# EAGLE design BPM_RULE_COMPLIANT_itr1_ver1 (EAGLE 9.6.2)
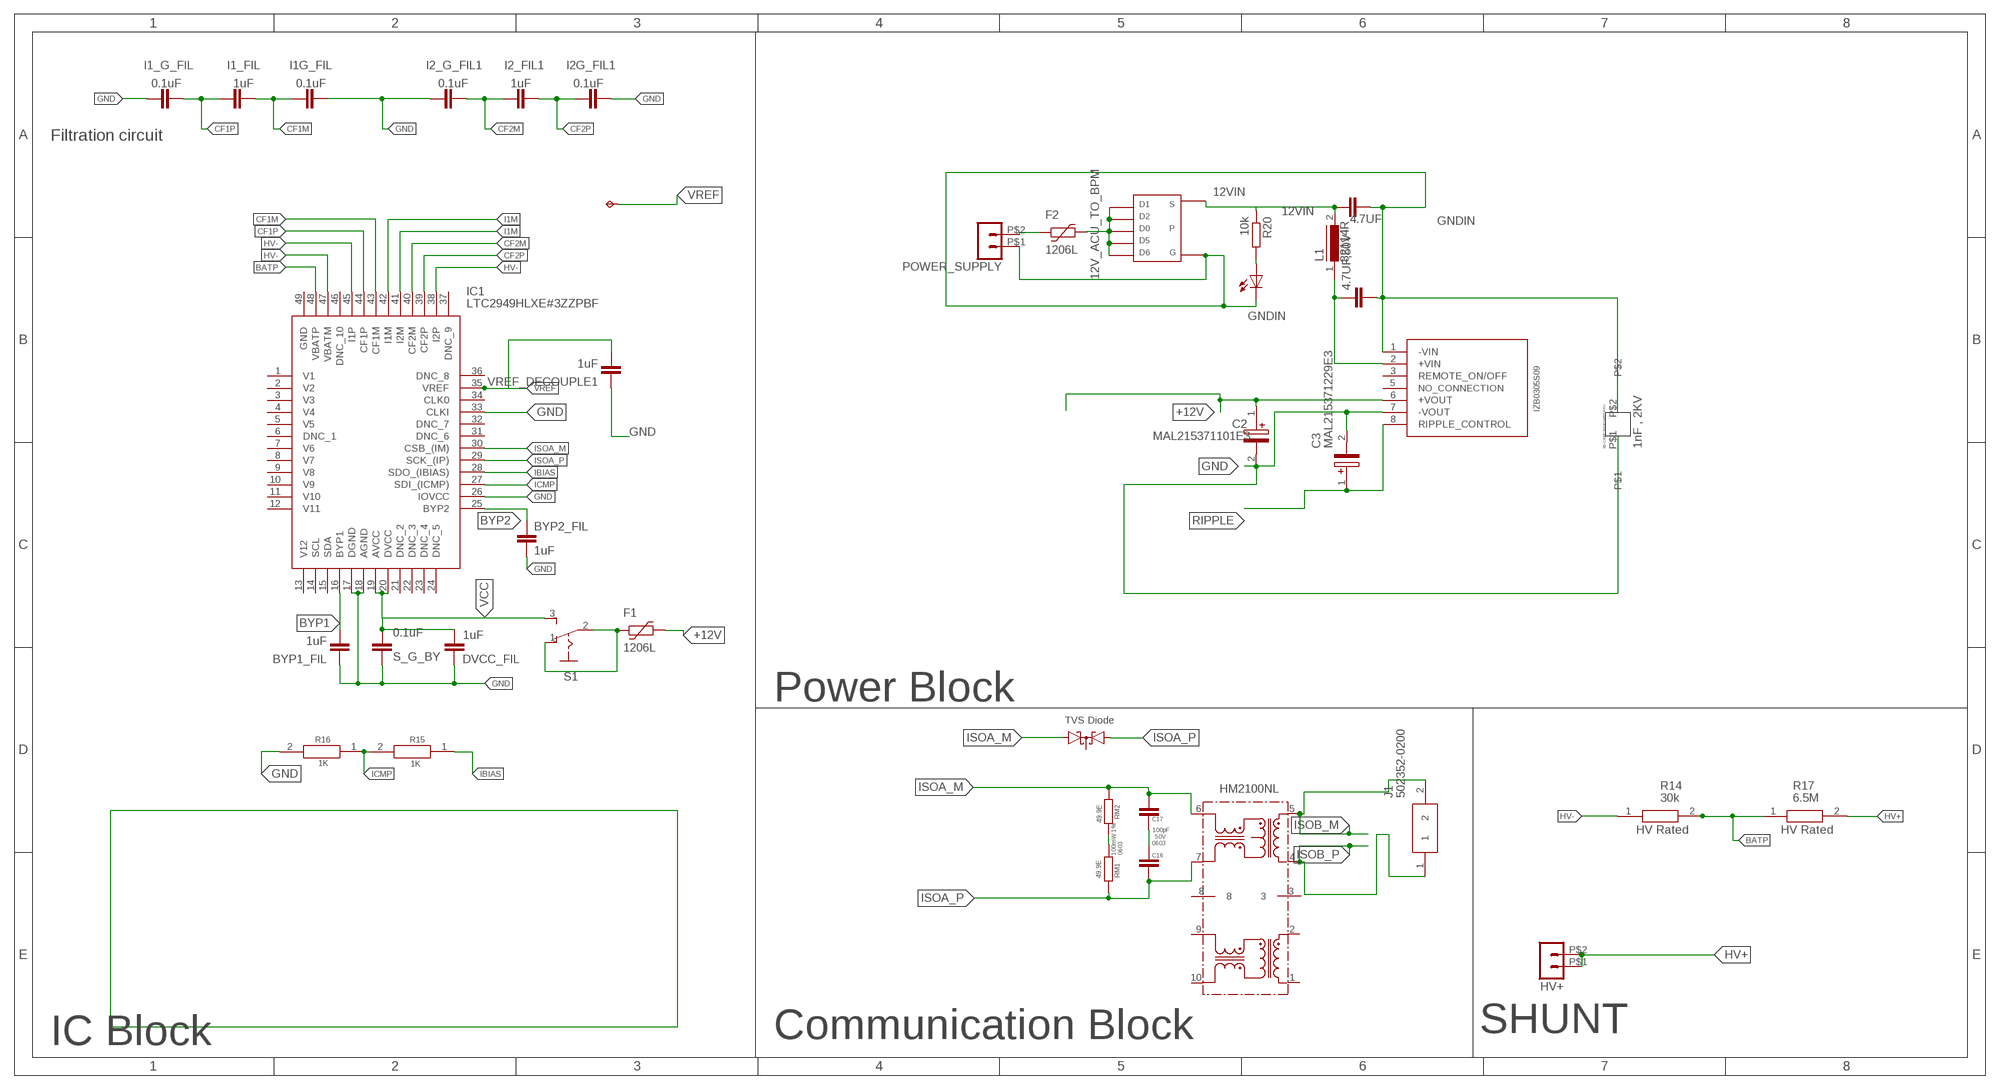
[diagram p0: schematic, sheet 1]

## Parts
4.7UF  C-EUC1206  [C1206]
4.7UF,50V  C-EUC1206  [C1206]
BYP1_FIL  1uF  C-EUC0603  [C0603]
BYP2_FIL  1uF  C-EUC0603  [C0603]
C2  MAL215371101E3  [CAPAE1060X1060N]
C3  MAL215371229E3  [CAPAE860X680N]
C15  TPPAD1-13  [P1-13]
C16  100pF  C-EUC0603  [C0603]
C17  100pF  C-EUC0603  [C0603]
DVCC_FIL  1uF  C-EUC0603  [C0603]
F1  1206L  [1206L]
F2  1206L  [1206L]
HM2100NL  HM2100NL  [HM2100NL]
HV+  MOLEX2PIN43650-0200  [43650-0200]
I1_FIL  1uF  C-EUC0603  [C0603]
I1_G_FIL  0.1uF  C-EUC0603  [C0603]
I1G_FIL  0.1uF  C-EUC0603  [C0603]
I2_FIL1  1uF  C-EUC0603  [C0603]
I2_G_FIL1  0.1uF  C-EUC0603  [C0603]
I2G_FIL1  0.1uF  C-EUC0603  [C0603]
IC1  LTC2949HLXE#3ZZPBF  [QFP50P900X900X160-49N]
IM1  TVS  BAS40-05  [SOT23]
J1  502352-0200  [5023520200]
L1  82114R  [82114R]
POWER_SUPPLY  MOLEX2PIN43045-0212  [43045-0212]
PWR_LED  LED-FKIT-1206  [FKIT-LED-1206]
R14  30k  HV73V2BTTD6494F  [RESC3216X70N]
R15  1K  CRCW06031K00FKEC  [RESC1608X50N]
R16  1K  CRCW06031K00FKEC  [RESC1608X50N]
R17  6.5M  HV73V2BTTD6494F  [RESC3216X70N]
R20  10k  R-EU_R0805  [R0805]
RM1  49.9E  R-EU_R0603  [R0603]
RM2  49.9E  R-EU_R0603  [R0603]
S1  STS121PC04  [STS121PC04]
S_G_BY  0.1uF  C-EUC0603  [C0603]
U$1  BPM_CONV  [BPM_CONV]
U$2  80-C330C102KGR5TATU  [80-C330C102KGR5TATU]
U$10  TSOP-6_PMOS  [TSOP-6_PMOS]
VREF_DECOUPLE1  1uF  C-EUC0603  [C0603]

## Nets
12V_ACU_TO_BPM: F2.P$2 U$10.1 U$10.2 U$10.5 U$10.6 U$10.D(D0)
12VIN: 4.7UF.1 L1.2 R20.1 U$10.S
+12V: C2.1(+) F1.P$2 U$1.6(+VOUT)
BATP: IC1.48(VBATP) R14.2 R17.1
BYP1: BYP1_FIL.2 IC1.16(BYP1)
BYP2: BYP2_FIL.1 IC1.25(BYP2)
CF1M: I1_FIL.1 I1G_FIL.1 IC1.43(CF1M)
CF1P: I1_FIL.2 I1_G_FIL.2 IC1.44(CF1P)
CF2M: I2_FIL1.2 I2_G_FIL1.1 IC1.40(CF2M)
CF2P: I2_FIL1.1 I2G_FIL1.1 IC1.39(CF2P)
GND: BYP1_FIL.1 BYP2_FIL.2 C2.2(-) C3.2(-) DVCC_FIL.1 I1_G_FIL.1 I1G_FIL.2 I2_G_FIL1.2 I2G_FIL1.2 IC1.17(DGND) IC1.18(AGND) IC1.26(IOVCC) IC1.33(CLKI) R16.2 S_G_BY.1 U$1.7(-VOUT) U$2.P$1 VREF_DECOUPLE1.1
GNDIN: 4.7UF,50V.2 4.7UF.2 POWER_SUPPLY.P$1 PWR_LED.C U$1.1(-VIN) U$2.P$2 U$10.G
HV+: HV+.P$1 HV+.P$2 R17.2
HV-: IC1.38(I2P) IC1.45(I1P) IC1.47(VBATM) R14.1
I1M: IC1.41(I2M) IC1.42(I1M)
IBIAS: IC1.28(SDO_(IBIAS)) R15.1
ICMP: IC1.27(SDI_(ICMP)) R15.2 R16.1
ISOA_M: C17.2 HM2100NL.6 IC1.30(CSB_(IM)) IM1.2(A2) RM2.1
ISOA_P: C16.1 HM2100NL.7 IC1.29(SCK_(IP)) IM1.1(A1) RM1.2
ISOB_M: HM2100NL.5 J1.2
ISOB_P: HM2100NL.4 J1.1
N$: RM1.1 RM2.2
N$1: 4.7UF,50V.1 L1.1 U$1.2(+VIN)
N$3: F2.P$1 POWER_SUPPLY.P$2
N$5: PWR_LED.A R20.2
N$8: F1.P$1 S1.1(O) S1.2(P)
N$15: C16.2 C17.1
RIPPLE: C3.1(+) U$1.8(RIPPLE_CONTROL)
VCC: DVCC_FIL.2 IC1.19(AVCC) IC1.20(DVCC) S1.3(S) S_G_BY.2
VREF: C15.TP IC1.35(VREF) VREF_DECOUPLE1.2
Unconnected: HM2100NL.1 HM2100NL.2 HM2100NL.3 HM2100NL.8 HM2100NL.9 HM2100NL.10 IC1.1(V1) IC1.2(V2) IC1.3(V3) IC1.4(V4) IC1.5(V5) IC1.6(DNC_1) IC1.7(V6) IC1.8(V7) IC1.9(V8) IC1.10(V9) IC1.11(V10) IC1.12(V11) IC1.13(V12) IC1.14(SCL) IC1.15(SDA) IC1.21(DNC_2) IC1.22(DNC_3) IC1.23(DNC_4) IC1.24(DNC_5) IC1.31(DNC_6) IC1.32(DNC_7) IC1.34(CLK0) IC1.36(DNC_8) IC1.37(DNC_9) IC1.46(DNC_10) IC1.49(GND) IM1.3(C) U$1.3(REMOTE_ON/OFF)

## Notes on the sheet
- Filtration circuit
- Power Block
- TVS Diode
- HV Rated | HV Rated
- 50V
  0603
- 100mW 1%
  0603
- IC Block | Communication Block | SHUNT

## Library data of the parts
4.7UF 4.7UF,50V = IIT_BOMBAY_Racing:C-EU: CAPACITOR, European symbol
BYP1_FIL BYP2_FIL DVCC_FIL I1_FIL I1_G_FIL I1G_FIL I2_FIL1 I2_G_FIL1 I2G_FIL1 S_G_BY VREF_DECOUPLE1 = rcl:C-EU: CAPACITOR, European symbol; SPICEPREFIX: C
C2 = SamacSys_Parts:MAL215371101E3: Aluminum Electrolytic Capacitors - SMD 100uF 50volts Source: Datasheet <https://datasheet.datasheetarchive.com/originals/distributors/DKDS-23/453117.pdf>; DESCRIPTION: Aluminum Electrolytic Capacitors - SMD 100uF 50volts; HEIGHT: 10.6mm; MANUFACTURER_NAME: Vishay; MANUFACTURER_PART_NUMBER: MAL215371101E3; MOUSER_PART_NUMBER: 594-MAL215371101E3; MOUSER_PRICE-STOCK: https://www.mouser.co.uk/ProductDetail/Vishay-BC-Components/MAL215371101E3?qs=qmStTZH4TzkcbcK0Zbtrsw%3D%3D
C3 = SamacSys_Parts:MAL215371229E3: Aluminum Electrolytic Capacitors - SMD 50V 22uF 20% Source: Datasheet <https://www.vishay.com/docs/28388/153crv.pdf>; DESCRIPTION: Aluminum Electrolytic Capacitors - SMD 50V 22uF 20%; HEIGHT: 6.8mm; MANUFACTURER_NAME: Vishay; MANUFACTURER_PART_NUMBER: MAL215371229E3; MOUSER_PART_NUMBER: 594-MAL215371229E3; MOUSER_PRICE-STOCK: https://www.mouser.co.uk/ProductDetail/Vishay-BC-Components/MAL215371229E3?qs=qmStTZH4TzmrNC0jpxbHVw%3D%3D
C15 = testpad:TP: Test pad
C16 C17 = resistor:C-EU: CAPACITOR, European symbol; MID: GCD188R71H103KA01D
F1 F2 = IIT_BOMBAY_Racing:1206L
HM2100NL = HM2100NL:HM2100NL
HV+ POWER_SUPPLY = IIT_BOMBAY_Racing2 (1):MOLEX2PIN: Molex - Micro-Fit 3.0 Series connector, 3.00mm (0.118") pitch header, 2 positions.
IC1 = SamacSys_Parts:LTC2949HLXE#3ZZPBF: Battery Management 60V Bat Gas Gauge w/ Temp, V & C Measure Source: Datasheet <https://www.analog.com/media/en/technical-documentation/data-sheets/LTC2949.pdf>; DESCRIPTION: Battery Management 60V Bat Gas Gauge w/ Temp, V & C Measure; HEIGHT: 1.6mm; MANUFACTURER_NAME: Analog Devices; MANUFACTURER_PART_NUMBER: LTC2949HLXE#3ZZPBF; MOUSER_PART_NUMBER: 584-949HLXE#3ZZPBF; MOUSER_PRICE-STOCK: https://www.mouser.co.uk/ProductDetail/Analog-Devices-Linear-Technology/LTC2949HLXE3ZZPBF?qs=wnTfsH77Xs63l8yDYlqztA%3D%3D
IM1 = diode:BAS40-05: Silicon Schottky Diodes General-purpose diode for high-speed switching
J1 = SamacSys_Parts:502352-0200: Molex DURACLIK 502352, 2mm Pitch, 2 Way, 1 Row, Right Angle PCB Header, Surface Mount Source: Datasheet <https://www.molex.com/pdm_docs/sd/5023520200_sd.pdf>; DESCRIPTION: Molex DURACLIK 502352, 2mm Pitch, 2 Way, 1 Row, Right Angle PCB Header, Surface Mount; HEIGHT: mm; MANUFACTURER_NAME: Molex; MANUFACTURER_PART_NUMBER: 502352-0200; MOUSER_PART_NUMBER: 538-502352-0200; MOUSER_PRICE-STOCK: https://www.mouser.co.uk/ProductDetail/Molex/502352-0200?qs=cPOO8qjhL6OPJnOOkJoW%252Bw%3D%3D
L1 = inductors:82114R: INDUCTOR; SPICEPREFIX: L
PWR_LED = IIT_BOMBAY_Racing:LED: LEDs Standard schematic elements and footprints for 5mm, 3mm, 1206, and 0603 sized LEDs. 5mm - Spark Fun Electronics SKU : COM-00529 (and others)
R14 R17 = SamacSys_Parts:HV73V2BTTD6494F: Thick Film Resistors - SMD 6490000Ohms 1% 1206 TCR=100 AEC-Q200 Source: Datasheet <https://www.mouser.ch/datasheet/2/219/HV73V-958787.pdf>; DESCRIPTION: Thick Film Resistors - SMD 6490000Ohms 1% 1206 TCR=100 AEC-Q200; HEIGHT: 0.7mm; MANUFACTURER_NAME: KOA Speer; MANUFACTURER_PART_NUMBER: HV73V2BTTD6494F
R15 R16 = SamacSys_Parts:CRCW06031K00FKEC: VISHAY - CRCW06031K00FKEC - RES, AEC-Q200, THICK FILM, 1K, 0.1W, 0603 Source: Datasheet <http://www.vishay.com/docs/20035/dcrcwe3.pdf>; ARROW_PART_NUMBER: CRCW06031K00FKEC; ARROW_PRICE-STOCK: https://www.arrow.com/en/products/crcw06031k00fkec/vishay; DESCRIPTION: VISHAY - CRCW06031K00FKEC - RES, AEC-Q200, THICK FILM, 1K, 0.1W, 0603; HEIGHT: 0.5mm; MANUFACTURER_NAME: Vishay; MANUFACTURER_PART_NUMBER: CRCW06031K00FKEC; MOUSER_PART_NUMBER: 71-CRCW06031K00FKEC; MOUSER_PRICE-STOCK: https://www.mouser.co.uk/ProductDetail/Vishay-Dale/CRCW06031K00FKEC?qs=LTJBsG9vER03gQprIr9%2F9w%3D%3D
R20 = IIT_BOMBAY_Racing:R-EU_: RESISTOR, European symbol
RM1 RM2 = resistor:R-EU_: RESISTOR, European symbol; MID: CRCW0603120RFKEAHP
S1 = switches:STS121PC04: SLIDING SWITCH Distributor Buerklin, 11G810
U$1 = BPM_CONV:BPM_CONV
U$2 = 80-C330C102KGR5TATU:80-C330C102KGR5TATU
U$10 = TSOP-6_MOS:TSOP-6_PMOS

## Net classes
0 default: width 0.127 mm, drill 0.127 mm, clearance 0.127 mm
1 differential: width 0.305 mm

## Board
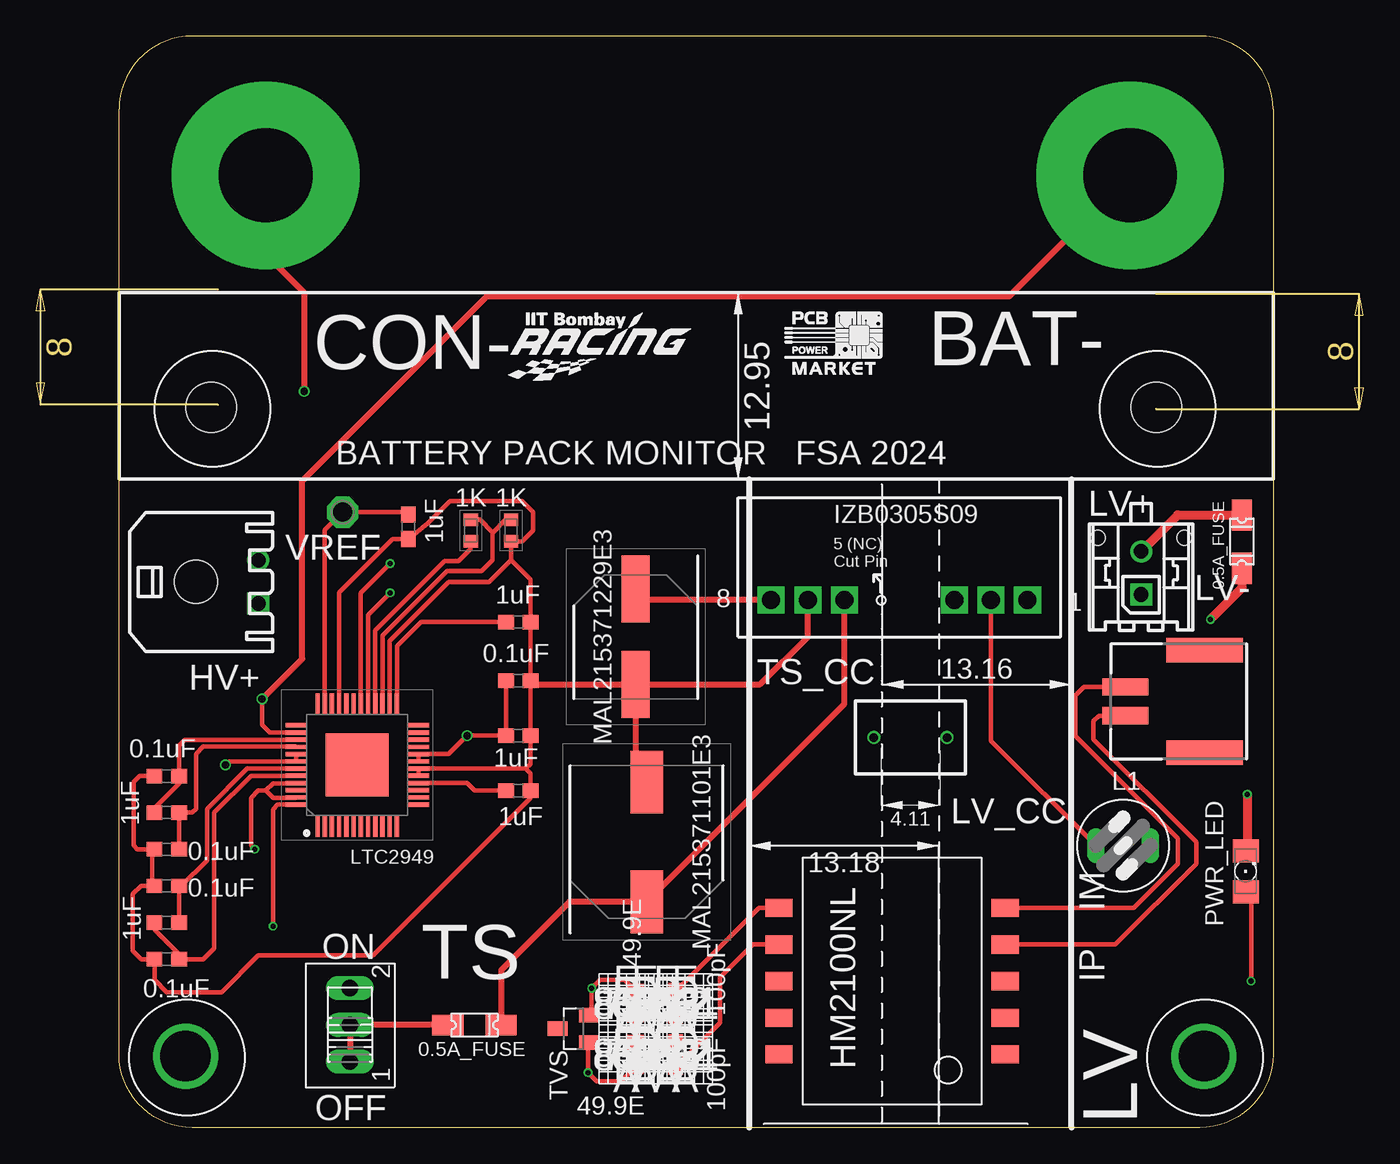
[diagram p1: board, top side]
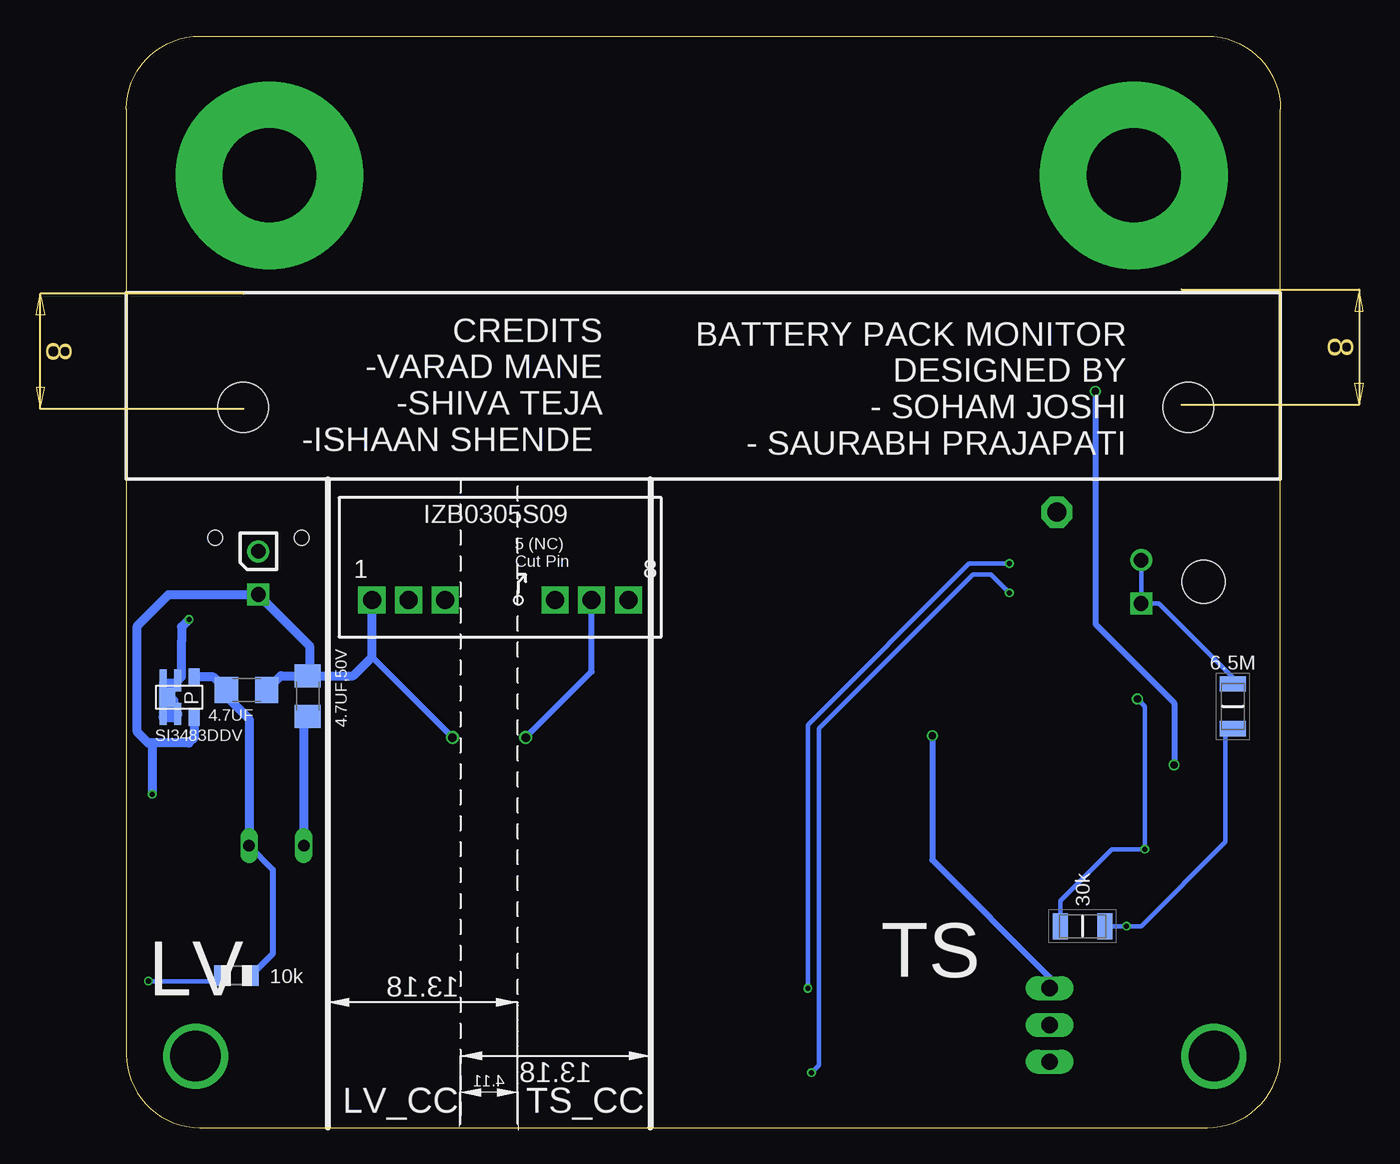
[diagram p2: board, bottom side, seen from below]

Size 80.01 x 75.69 mm. Coordinates in mm from the lower left corner, seen from the top.
Outline: 80.01,70.61 80.01,5.08 arc-90 74.93,0 5.08,0 arc-90 0,5.08 0,70.61 arc-90 5.08,75.69 74.93,75.69 arc-90 80.01,70.61
Copper layers (1*16): Top 0.035mm / dielectric 1.5mm / Bottom 0.035mm
Design rules "PCB_Power": minimum track width 5mil, minimum drill 10mil, track to track 5mil, track to pad 5mil, pad to pad 5mil, via to via 5mil, smd to smd 5mil, copper to edge 10mil, drill to drill 6mil, minimum pad ring 5mil, minimum via ring 5mil, stop-mask expansion 3mil, vias tented up to drill 0mil, thermal gap 10mil
Holes 3.5 mm at 6.39,49.95 71.92,49.95

### Footprints (pad centres in the part's own frame; a part is rotated, then mirrored left to right if it is on the bottom)
C1206 = smd 1.6 x 1.8: 1 -1.4,0; 2 1.4,0
C0603 = smd 1.1 x 1: 1 -0.85,0; 2 0.85,0
CAPAE1060X1060N = smd 4.35 x 2.25: 1 -4.15,0; 2 4.15,0
CAPAE860X680N = smd 4.65 x 1.95: 1 -3.3,0; 2 3.3,0
P1-13 = drill 1.321 pad 2.159 octagon: TP 0,0
1206L = smd 2.16 x 1.4: P$1 -1.85,0; P$2 1.85,0
HM2100NL = smd 1.27 x 1.89: 1 -5.08,-7.84; 2 -2.54,-7.84; 3 0,-7.84; 4 2.54,-7.84; 5 5.08,-7.84; 6 5.08,7.84; 7 2.54,7.84; 8 0,7.84; 9 -2.54,7.84; 10 -5.08,7.84
43650-0200 = drill 1.02 square: P$1 1.5,4.32 | drill 1.02: P$2 -1.5,4.32 | hole 3: 0,0
QFP50P900X900X160-49N = smd 1.475 x 0.3: 1 -4.238,2.75; 2 -4.238,2.25; 3 -4.238,1.75; 4 -4.238,1.25; 5 -4.238,0.75; 6 -4.238,0.25; 7 -4.238,-0.25; 8 -4.238,-0.75; 9 -4.238,-1.25; 10 -4.238,-1.75; 11 -4.238,-2.25; 12 -4.238,-2.75; 25 4.238,-2.75; 26 4.238,-2.25; 27 4.238,-1.75; 28 4.238,-1.25; 29 4.238,-0.75; 30 4.238,-0.25; 31 4.238,0.25; 32 4.238,0.75; 33 4.238,1.25; 34 4.238,1.75; 35 4.238,2.25; 36 4.238,2.75 | smd 0.3 x 1.475: 13 -2.75,-4.238; 14 -2.25,-4.238; 15 -1.75,-4.238; 16 -1.25,-4.238; 17 -0.75,-4.238; 18 -0.25,-4.238; 19 0.25,-4.238; 20 0.75,-4.238; 21 1.25,-4.238; 22 1.75,-4.238; 23 2.25,-4.238; 24 2.75,-4.238; 37 2.75,4.238; 38 2.25,4.238; 39 1.75,4.238; 40 1.25,4.238; 41 0.75,4.238; 42 0.25,4.238; 43 -0.25,4.238; 44 -0.75,4.238; 45 -1.25,4.238; 46 -1.75,4.238; 47 -2.25,4.238; 48 -2.75,4.238 | smd 4.35 x 4.35: 49 0,0
SOT23 = smd 1 x 1.4: 1 -0.95,-1.1; 2 0.95,-1.1; 3 0,1.1
5023520200 = smd 1.2 x 3.2: 1 -1,-1; 2 1,-1 | smd 1.7 x 5.3: 3 -3.55,-6.48; 4 3.55,-6.48
82114R = drill 0.813 long: 1 0,1.905; 2 0,-1.905
43045-0212 = drill 1.02 square: P$1 0,0 | drill 1.02: P$2 0,3 | hole 1.02: 3,3.94; -3,3.94
FKIT-LED-1206 = smd 1.6 x 1.803: A -1.422,0; C 1.422,0
RESC3216X70N = smd 1.05 x 1.8: 1 -1.55,0; 2 1.55,0
RESC1608X50N = smd 0.85 x 1: 1 -0.75,0; 2 0.75,0
R0805 = smd 1.1 x 1.4: 1 -1,0; 2 1,0
R0603 = smd 1 x 1.1: 1 -0.85,0; 2 0.85,0
STS121PC04 = drill 1.118 long: 1 -3.81,0; 2 -1.27,0; 3 1.29,0
BPM_CONV = drill 1.25 square: 1 0,0; 2 -2.54,0; 3 -5.08,0; 6 -12.7,0; 7 -15.24,0; 8 -17.78,0
80-C330C102KGR5TATU = drill 0.6: P$1 -2.54,0; P$2 2.54,0
TSOP-6_PMOS = smd 0.5 x 1.92: 1 -1,-0.96; 6 -1,0.96 | smd 0.5 x 1.52: 2 0,-1.16; 5 0,1.16 | smd 0.635 x 1.27: D -0.5,0 | smd 0.75 x 1.2: G 1.13,-1.4; S 1.13,1.4

### Placement (x,y rotation side)
4.7UF  71.68,30.35 0 bottom
4.7UF,50V  67.44,29.92 90 bottom
BYP1_FIL  27.69,23.37 180 top
BYP2_FIL  27.69,35.05 0 top
C2  36.58,19.81 90 top
C3  35.81,34.04 270 top
C15  15.49,42.67 90 top
C16  38.61,5.08 90 top
C17  38.61,8.64 90 top
DVCC_FIL  27.69,27.18 180 top
F1  24.64,7.11 0 top
F2  77.85,40.64 270 top
HM2100NL  53.59,10.16 90 top
HV+  5.33,37.85 270 top
I1_FIL  3.3,14.22 180 top
I1_G_FIL  3.3,11.68 0 top
I1G_FIL  3.3,16.76 180 top
I2_FIL1  3.3,21.84 0 top
I2_G_FIL1  3.3,19.3 180 top
I2G_FIL1  3.3,24.38 180 top
IC1  16.51,25.15 90 top
IM1  31.5,6.86 90 top
J1  68.77,29.56 90 top
L1  69.61,19.56 90 top
POWER_SUPPLY  70.87,36.96 0 top
PWR_LED  78.11,17.78 90 top
R14  13.72,13.97 0 bottom
R15  24.38,41.4 90 top
R16  27.18,41.4 270 top
R17  3.3,29.21 90 bottom
R20  72.39,10.54 180 bottom
RM1  35.81,5.08 270 top
RM2  35.81,8.64 270 top
S1  16,8.38 90 top
S_G_BY  27.69,30.99 180 top
U$1  62.99,36.58 0 top
U$2  54.86,27.05 0 top
U$6  LOGO_PCBPOWER  [270X170]  46.1,52.2 0 top
U$10  76.45,29.84 0 bottom
U$22  [RACING_LOGO_190MIL]  26.76,51.61 0 top
VREF_DECOUPLE1  20.07,41.66 90 top

### Tracks (layer width: path | path; a pad name or v marks a point on that pad's centre or on a via)
12V_ACU_TO_BPM  (via drill 0.35)
  Top 0.61: F2.P$2 77.85,37.41 v75.68,35.23
  Bottom 0.61: v75.68,35.23 76.18,34.73 76.18,33.71 76.2,33.69 76.2,31.26 U$10.5 76.65,30.8 | 76.65,30.8 U$10.6 | U$10.6 77.45,29.97 | 77.45,29.97 77.45,28.96 | 77.45,28.96 77.45,28.46 77.47,28.45 76.69,28.45 | 76.69,28.45 U$10.2 | U$10.2 76.71,28.94 76.71,29.6 U$10.D | U$10.D 77.08,29.97 | 77.08,29.97 77.45,29.97 | U$10.D 76.95,30.5 76.65,30.8 | U$10.6 77.45,30.34 77.08,29.97 | 76.69,28.45 77.2,28.96 77.45,28.96 | U$10.1 76.65,28.89 U$10.2
12VIN
  Bottom 0.406: L1.2 69.87,17.91 69.87,12.07 R20.1
  Bottom 0.61: L1.2 71.52,28.34 73.08,29.9 4.7UF.1 73.97,31.25 U$10.S
+12V
  Top 0.406: F1.P$2 26.49,10.92 31.23,15.66 C2.1 50.29,29.38 U$1.6
BATP  (via drill 0.35)
  Top 0.305: IC1.48 11,22.4 10.67,22.06 v10.67,13.97
  Bottom 0.305: 12.17,13.46 R14.2 v10.67,13.97 9.65,13.97 3.81,19.81 3.81,27.41 3.56,27.66 R17.1
BYP1
  Top 0.305: BYP1_FIL.2 24.64,23.37 24.11,23.9 IC1.16
BYP2
  Top 0.305: BYP2_FIL.1 20.93,35.05 19.26,33.38 IC1.25
CF1M
  Top 0.305: I1_FIL.1 I1G_FIL.1 4.32,16.76 6.1,18.54 6.1,22.1 8.89,24.9 IC1.43
CF1P
  Top 0.305: 4.32,11.68 I1_G_FIL.2 4.15,12.02 2.45,13.72 I1_FIL.2 | 4.32,11.85 4.32,11.68 | IC1.44 9.14,24.4 6.6,21.86 6.6,12.45 5.84,11.68 4.32,11.68
CF2M
  Top 0.305: I2_G_FIL1.1 I2_FIL1.2 5.08,21.84 5.33,22.1 5.33,25.91 5.84,26.42 12.25,26.42 IC1.40
CF2P
  Top 0.305: I2_FIL1.1 2.45,22.18 4.15,23.88 I2G_FIL1.1 4.15,26.5 4.54,26.9 IC1.39
GND
  Top 0.305: S_G_BY.1 28.79,30.73 | S_G_BY.1 DVCC_FIL.1 28.54,25.23 28.19,24.89 | S_G_BY.1 BYP2_FIL.2 28.54,38.01 27.18,39.37 | IC1.17 IC1.18 28.19,24.9 28.19,24.89 | 27.18,39.37 R16.2 27.19,40.64 27.94,40.64 28.7,41.4 28.7,42.67 27.94,43.43 22.95,43.43 21.42,41.91 VREF_DECOUPLE1.1 18.96,40.81 15.26,37.1 IC1.33 | 28.62,23.45 BYP1_FIL.1 | 27.18,39.37 25.65,37.85 22.86,37.85 18.76,33.75 IC1.26 18.76,29.94 | I2_G_FIL1.2 2.42,19.3 | C3.2 | BYP1_FIL.1 28.54,24.55 28.19,24.89 | BYP1_FIL.1 28.54,22.86 17.61,11.94 9.65,11.94 7.11,9.4 3.3,9.4 2.45,10.25 I1_G_FIL.1 1.52,11.68 0.95,12.26 0.95,16.19 1.52,16.76 2.29,16.76 | 2.29,16.76 I1G_FIL.2 | I2_G_FIL1.2 2.29,19.14 2.29,16.76 | I2_G_FIL1.2 1.27,19.3 1.02,19.56 1.02,23.96 1.44,24.38 I2G_FIL1.2
  Top 0.406: 28.79,30.73 C3.2 | C2.2 35.81,24.72 C3.2 44.45,30.74 47.75,34.04 U$1.7
  Bottom 0.406: U$2.P$1 47.75,31.62 U$1.7
GND_1  (via drill 3.5)
  other vias: 4.61,4.96
GND_3  (via drill 3.5)
  other vias: 75.22,4.96
GNDIN  (via drill 0.35)
  Top 0.61: v78.23,23.11 78.23,19.33 PWR_LED.C
  Bottom 0.406: U$2.P$2 62.99,32.64
  Bottom 0.61: 4.7UF,50V.2 64.31,31.32 62.99,32.64 U$1.1 | 4.7UF.2 69.31,31.32 4.7UF,50V.2 | 4.7UF,50V.2 67.31,31.45 67.31,33.41 POWER_SUPPLY.P$1 77.08,36.96 79.25,34.8 79.25,27.43 78.49,26.67 78.23,26.67 | U$10.G 75.32,27.04 75.69,26.67 78.23,26.67 | 78.23,26.67 v78.23,23.11
HV+
  Bottom 0.305: R17.2 3.3,31.22 8.43,36.35 HV+.P$1 HV+.P$2
HV-  (via drill 0.35, 0.5 pad 0.65, 6.5 pad 13)
  Top 0.305: v9.91,29.72 9.91,27.94 10.45,27.4 IC1.38 | IC1.45 12.25,23.88 10.67,23.88 10.16,23.37 | IC1.47 12.24,22.86 10.67,22.86 10.16,23.37 | 10.16,23.37 9.65,23.37 9.14,22.86 9.14,19.56 v9.4,19.3
  Top 0.406: v9.91,29.72 12.7,32.51 12.7,44.83 25.53,57.66 61.72,57.66 v70.1,66.04
  Bottom 0.305: R14.1 15.27,15.72 11.68,19.3 v9.4,19.3 9.4,29.21 v9.91,29.72
I1M  (via drill 0.5 pad 0.65, 6.5 pad 13)
  Top 0.305: v7.37,25.15 7.62,25.4 IC1.42 IC1.41
  Top 0.406: v10.16,66.04 10.16,60.58 12.83,57.91 v12.83,51.05
  Bottom 0.406: v7.37,25.15 7.37,29.46 12.83,34.92 v12.83,51.05
IBIAS
  Top 0.305: R15.1 24.38,40.13 23.55,39.29 22.58,39.29 17.76,34.47 IC1.28
ICMP
  Top 0.305: 25.91,41.27 26.8,42.15 R16.1 | IC1.27 18.26,34.11 22.76,38.61 25.15,38.61 25.91,39.37 25.91,41.27 | R15.2 25.03,42.15 25.91,41.27
ISOA_M  (via drill 0.35)
  Top 0.305: IM1.2 32.77,7.98 v32.77,9.65 33.36,10.25 35.05,10.25 RM2.1 C17.2 44.36,15.24 HM2100NL.6 | IC1.30 16.76,37.08 v18.8,39.12
  Bottom 0.305: v18.8,39.12 21.59,39.12 32.77,27.94 v32.77,9.65
ISOA_P  (via drill 0.35)
  Top 0.305: IM1.1 32.51,5.82 v32.51,3.81 33.11,3.21 34.8,3.21 RM1.2 C16.1 41.66,7.28 41.66,10.41 43.94,12.7 HM2100NL.7 | v18.8,37.08 17.26,35.55 IC1.29
  Bottom 0.305: v18.8,37.08 20.07,38.35 21.34,38.35 32,27.69 32,4.32 v32.51,3.81
ISOB_M
  Top 0.305: 69.6,30.73 J1.2 66.88,30.56 66.29,29.97 66.29,27.16 73.41,20.04 73.41,18.29 70.36,15.24 HM2100NL.5 61.61,15.07
ISOB_P
  Top 0.305: 61.69,12.95 HM2100NL.4 69.09,12.7 74.68,18.29 74.68,19.81 67.56,26.92 67.56,28.19 67.93,28.56 J1.1 69.66,28.45
N$
  Top 0.305: RM1.1 RM2.2
N$1
  Top 0.305: L1.1 60.45,26.81 U$1.2
  Bottom 0.61: 4.7UF,50V.1 67.71,28.25 L1.1
N$3
  Top 0.61: 77.85,43.14 F2.P$1 73.39,42.49 POWER_SUPPLY.P$2
N$5  (via drill 0.35)
  Top 0.305: PWR_LED.A 78.49,15.98 v78.49,10.16
  Top 0.406: 78,16.26 PWR_LED.A
  Bottom 0.305: v78.49,10.16 73.77,10.16 R20.2
N$8
  Top 0.406: S1.1 S1.2 F1.P$1
N$15
  Top 0.305: C16.2 C17.1
RIPPLE
  Top 0.406: C3.1 36.58,36.57 U$1.8
VCC  (via drill 0.5 pad 0.65)
  Top 0.305: S_G_BY.2 DVCC_FIL.2 v24.13,27.18 22.86,25.91 20.76,25.91 IC1.20 | IC1.19 IC1.20 | 20.82,25.9 IC1.20
  Bottom 0.406: v24.13,27.18 24.13,18.56 16,10.43 S1.3
VREF
  Top 0.305: 19.81,42.25 VREF_DECOUPLE1.2 19.9,42.67 C15.TP 14.26,41.44 IC1.35

### Text on the board
tPlace: BATTERY PACK MONITOR FSA 2024 | TS_CC | LV_CC | TS | LV
bPlace: TS | LV | TS_CC | LV_CC
tNames: BAT- | CON- | LV+ | VREF | LV- | HV+ | 0.1uF | 0.1uF | LTC2949 | IM | 0.1uF | 1uF | ON | IP | 0.5A_FUSE | OFF
bNames: BATTERY PACK MONITOR / DESIGNED BY / - SOHAM JOSHI / - SAURABH PRAJAPATI | CREDITS / -VARAD MANE / -SHIVA TEJA / -ISHAAN SHENDE